# EAGLE design FeedbackShieldV4 (1) (EAGLE 9.7.0)
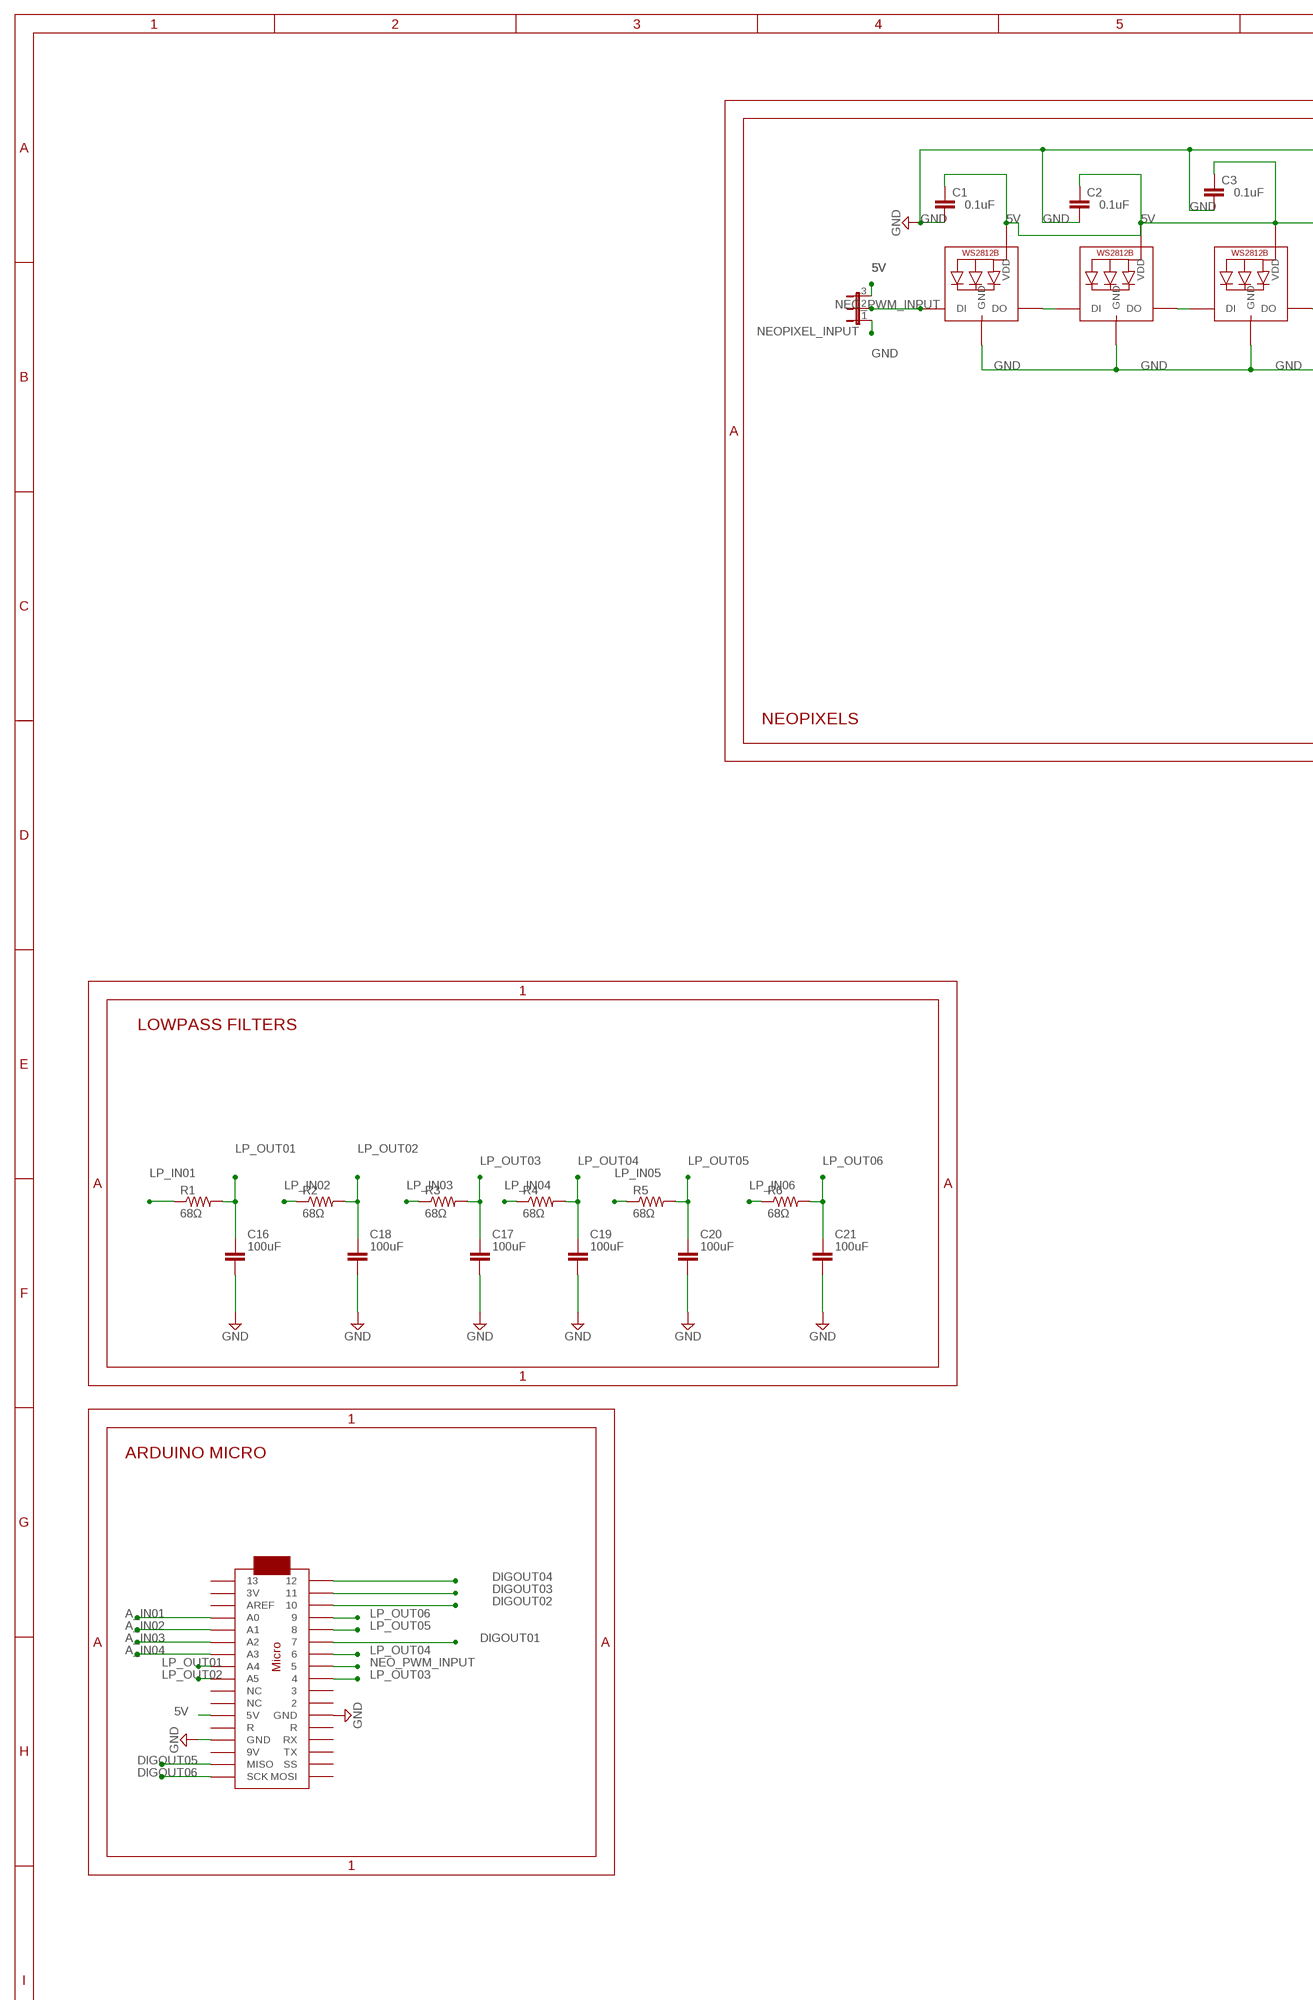
[diagram p0: schematic, sheet 1, part 1 of 2]
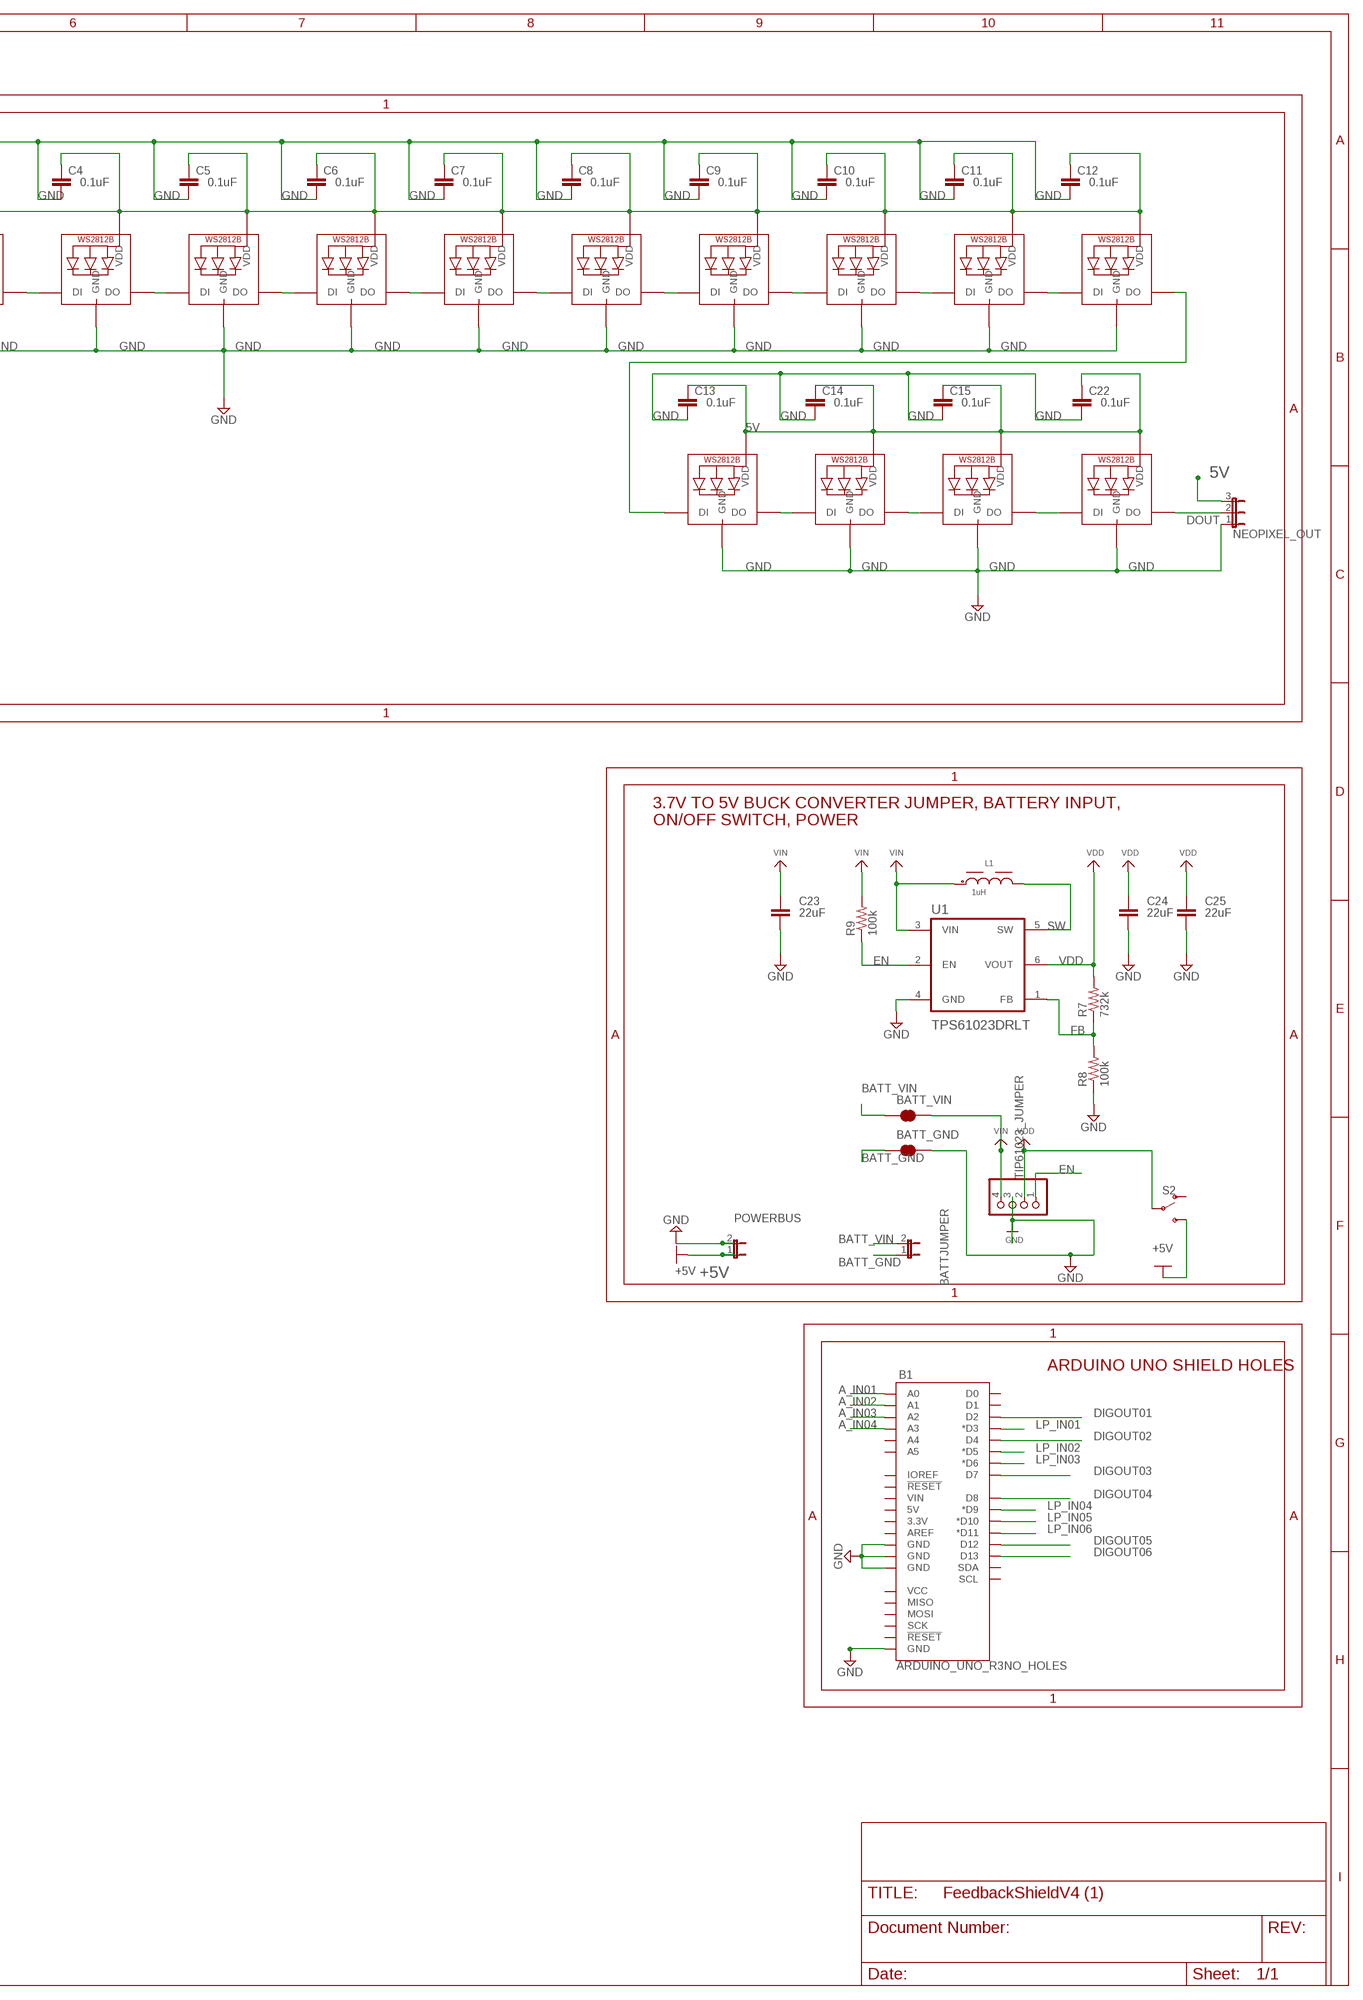
[diagram p1: schematic, sheet 1, part 2 of 2]

## Parts
B1  ARDUINO_UNO_R3NO_HOLES  [ARDUINO_R3_NO_HOLES]
BATT_GND  JUMPER-SMT_2_NC_TRACE_SILK  [SMT-JUMPER_2_NC_TRACE_SILK]
BATT_VIN  JUMPER-SMT_2_NC_TRACE_SILK  [SMT-JUMPER_2_NC_TRACE_SILK]
BATTJUMPER  JP1E  [JP1]
C1  0.1uF  C_CHIP-0603(1608-METRIC)  [CAPC1608X85]
C2  0.1uF  C_CHIP-0603(1608-METRIC)  [CAPC1608X85]
C3  0.1uF  C_CHIP-0603(1608-METRIC)  [CAPC1608X85]
C4  0.1uF  C_CHIP-0603(1608-METRIC)  [CAPC1608X85]
C5  0.1uF  C_CHIP-0603(1608-METRIC)  [CAPC1608X85]
C6  0.1uF  C_CHIP-0603(1608-METRIC)  [CAPC1608X85]
C7  0.1uF  C_CHIP-0603(1608-METRIC)  [CAPC1608X85]
C8  0.1uF  C_CHIP-0603(1608-METRIC)  [CAPC1608X85]
C9  0.1uF  C_CHIP-0603(1608-METRIC)  [CAPC1608X85]
C10  0.1uF  C_CHIP-0603(1608-METRIC)  [CAPC1608X85]
C11  0.1uF  C_CHIP-0603(1608-METRIC)  [CAPC1608X85]
C12  0.1uF  C_CHIP-0603(1608-METRIC)  [CAPC1608X85]
C13  0.1uF  C_CHIP-0603(1608-METRIC)  [CAPC1608X85]
C14  0.1uF  C_CHIP-0603(1608-METRIC)  [CAPC1608X85]
C15  0.1uF  C_CHIP-0603(1608-METRIC)  [CAPC1608X85]
C16  100uF  C_CHIP-1206(3216-METRIC)  [CAPC3216X135]
C17  100uF  C_CHIP-1206(3216-METRIC)  [CAPC3216X135]
C18  100uF  C_CHIP-1206(3216-METRIC)  [CAPC3216X135]
C19  100uF  C_CHIP-1206(3216-METRIC)  [CAPC3216X135]
C20  100uF  C_CHIP-1206(3216-METRIC)  [CAPC3216X135]
C21  100uF  C_CHIP-1206(3216-METRIC)  [CAPC3216X135]
C22  0.1uF  C_CHIP-0603(1608-METRIC)  [CAPC1608X85]
C23  22uF  C_CHIP-0805(2012-METRIC)  [CAPC2012X110]
C24  22uF  C_CHIP-0805(2012-METRIC)  [CAPC2012X110]
C25  22uF  C_CHIP-0805(2012-METRIC)  [CAPC2012X110]
L1  1uH  WE-MAPI_4020_744383560033  [WE-MAPI_4020]
MICRO  ARDUINOMICRO  [ARDUINOMICRO]
NEOPIXEL_INPUT  JP2E  [JP2]
NEOPIXEL_OUT  JP2E  [JP2]
PIN2  WS2812B3535  [LED3535]
PIN3  WS2812B3535  [LED3535]
PIN4  WS2812B3535  [LED3535]
PIN5  WS2812B3535  [LED3535]
PIN6  WS2812B3535  [LED3535]
PIN7  WS2812B3535  [LED3535]
PIN8  WS2812B3535  [LED3535]
PIN9  WS2812B3535  [LED3535]
PIN10  WS2812B3535  [LED3535]
PIN11  WS2812B3535  [LED3535]
PIN12  WS2812B3535  [LED3535]
PIN13  WS2812B3535  [LED3535]
PINA0  WS2812B3535  [LED3535]
PINA1  WS2812B3535  [LED3535]
PINA2  WS2812B3535  [LED3535]
PINA3  WS2812B3535  [LED3535]
POWERBUS  JP1E  [JP1]
R1  68Ω  R-US_CHIP-0805(2012-METRIC)  [RESC2012X65]
R2  68Ω  R-US_CHIP-0805(2012-METRIC)  [RESC2012X65]
R3  68Ω  R-US_CHIP-0805(2012-METRIC)  [RESC2012X65]
R4  68Ω  R-US_CHIP-0805(2012-METRIC)  [RESC2012X65]
R5  68Ω  R-US_CHIP-0805(2012-METRIC)  [RESC2012X65]
R6  68Ω  R-US_CHIP-0805(2012-METRIC)  [RESC2012X65]
R7  732k  R-US_CHIP-0805(2012-METRIC)  [RESC2012X65]
R8  100k  R-US_CHIP-0805(2012-METRIC)  [RESC2012X65]
R9  100k  R-US_CHIP-0805(2012-METRIC)  [RESC2012X65]
S2  SWITCH-SPDT-SMD-RIGHT-ANGLE  [SWITCH_SPST_SMD_A]
TIP61023_JUMPER  HEADER-1X4ROUND  [1X04_ROUND]
U1  TPS61023DRLT  [SOT50P160X60-6N]

## Nets
5V: C1.1 C2.1 C3.1 C4.1 C5.1 C6.1 C7.1 C8.1 C9.1 C10.1 C11.1 C12.1 C13.1 C14.1 C15.1 C22.1 MICRO.P$23(5V) NEOPIXEL_INPUT.3 NEOPIXEL_OUT.3 PIN2.2(VDD) PIN3.2(VDD) PIN4.2(VDD) PIN5.2(VDD) PIN6.2(VDD) PIN7.2(VDD) PIN8.2(VDD) PIN9.2(VDD) PIN10.2(VDD) PIN11.2(VDD) PIN12.2(VDD) PIN13.2(VDD) PINA0.2(VDD) PINA1.2(VDD) PINA2.2(VDD) PINA3.2(VDD)
+5V: POWERBUS.1 S2.3(S)
A_IN01: B1.A0 MICRO.P$31(A0)
A_IN02: B1.A1 MICRO.P$30(A1)
A_IN03: B1.A2 MICRO.P$29(A2)
A_IN04: B1.A3 MICRO.P$28(A3)
BATT_GND: BATT_GND.1 BATTJUMPER.1
BATT_VIN: BATT_VIN.1 BATTJUMPER.2
DIGOUT01: B1.D2 MICRO.P$6
DIGOUT02: B1.D4 MICRO.P$3
DIGOUT03: B1.D7 MICRO.P$2
DIGOUT04: B1.D8 MICRO.P$1
DIGOUT05: B1.D12 MICRO.P$19(MISO)
DIGOUT06: B1.D13 MICRO.P$18(SCK)
DOUT: NEOPIXEL_OUT.2 PINA3.3(DO)
EN: R9.1 TIP61023_JUMPER.1 U1.2(EN)
FB: R7.1 R8.2 U1.1(FB)
GND: B1.GND@1(GND) B1.GND@2(GND) B1.GND@3(GND) B1.GND@4(GND) BATT_GND.2 C1.2 C2.2 C3.2 C4.2 C5.2 C6.2 C7.2 C8.2 C9.2 C10.2 C11.2 C12.2 C13.2 C14.2 C15.2 C16.2 C17.2 C18.2 C19.2 C20.2 C21.2 C22.2 C23.2 C24.2 C25.2 MICRO.P$12(GND) MICRO.P$21(GND) NEOPIXEL_INPUT.1 NEOPIXEL_OUT.1 PIN2.4(GND) PIN3.4(GND) PIN4.4(GND) PIN5.4(GND) PIN6.4(GND) PIN7.4(GND) PIN8.4(GND) PIN9.4(GND) PIN10.4(GND) PIN11.4(GND) PIN12.4(GND) PIN13.4(GND) PINA0.4(GND) PINA1.4(GND) PINA2.4(GND) PINA3.4(GND) POWERBUS.2 R8.1 TIP61023_JUMPER.3 U1.4(GND)
LP_IN01: B1.D3(*D3) R1.1
LP_IN02: B1.D5(*D5) R2.1
LP_IN03: B1.D6(*D6) R3.1
LP_IN04: B1.D9(*D9) R4.1
LP_IN05: B1.D10(*D10) R5.1
LP_IN06: B1.D11(*D11) R6.1
LP_OUT01: C16.1 MICRO.P$27(A4) R1.2
LP_OUT02: C18.1 MICRO.P$26(A5) R2.2
LP_OUT03: C17.1 MICRO.P$9 R3.2
LP_OUT04: C19.1 MICRO.P$7 R4.2
LP_OUT05: C20.1 MICRO.P$5 R5.2
LP_OUT06: C21.1 MICRO.P$4 R6.2
N$1: PINA2.3(DO) PINA3.1(DI)
N$5: PIN12.3(DO) PIN13.1(DI)
N$21: PIN2.3(DO) PIN3.1(DI)
N$22: PIN3.3(DO) PIN4.1(DI)
N$23: PIN4.3(DO) PIN5.1(DI)
N$24: PIN5.3(DO) PIN6.1(DI)
N$25: PIN6.3(DO) PIN7.1(DI)
N$26: PIN7.3(DO) PIN8.1(DI)
N$27: PIN8.3(DO) PIN9.1(DI)
N$28: PIN9.3(DO) PIN10.1(DI)
N$29: PIN10.3(DO) PIN11.1(DI)
N$30: PIN11.3(DO) PIN12.1(DI)
N$31: PIN13.3(DO) PINA0.1(DI)
N$33: PINA0.3(DO) PINA1.1(DI)
N$34: PINA1.3(DO) PINA2.1(DI)
NEO_PWM_INPUT: MICRO.P$8 NEOPIXEL_INPUT.2 PIN2.1(DI)
SW: L1.2 U1.5(SW)
VDD: C24.1 C25.1 R7.2 S2.2(P) TIP61023_JUMPER.2 U1.6(VOUT)
VIN: BATT_VIN.2 C23.1 L1.1 R9.2 TIP61023_JUMPER.4 U1.3(VIN)
Unconnected: B1.3.3V B1.5V B1.A4 B1.A5 B1.AREF B1.D0 B1.D1 B1.IOREF B1.MISO B1.MOSI B1.RESET@1(!RESET!) B1.RESET@2(!RESET!) B1.SCK B1.SCL B1.SDA B1.VCC B1.VIN MICRO.P$10 MICRO.P$11 MICRO.P$13(R) MICRO.P$14(RX) MICRO.P$15(TX) MICRO.P$16(SS) MICRO.P$17(MOSI) MICRO.P$20(9V) MICRO.P$22(R) MICRO.P$24(NC) MICRO.P$25(NC) MICRO.P$32(AREF) MICRO.P$33(3V) MICRO.P$34 S2.1(O)

## Notes on the sheet
- NEOPIXELS
- 3.7V TO 5V BUCK CONVERTER JUMPER, BATTERY INPUT,
  ON/OFF SWITCH, POWER
- LOWPASS FILTERS
- ARDUINO UNO SHIELD HOLES
- ARDUINO MICRO

## Library data of the parts
B1 = SparkFun-Boards:ARDUINO_UNO_R3: Arduino R3 Footprint with SPI header Arduino Uno R3 Compatible Footprint. Matches PCB size of the original board. SparkFun Products: SAMD21 Dev Breakout <https://www.sparkfun.com/products/13672> RedBoard <https://www.sparkfun.com/products/12757> R3 Stackable Headers <https://www.sparkfun.com/products/11417>
BATT_GND BATT_VIN = SparkFun-Jumpers:JUMPER-SMT_2_NC_TRACE: Normally closed trace jumper This jumper has a trace between two pads so it's normally closed (NC). Use a razor knife to open the connection. For best results follow the IPC guidelines for cutting traces: Cutout at least 0.063 mm (0.005 in). Remove all loose material to clean up the cut area. Seal the cut with an approved epoxy. Reapply solder to reclose the connection.
BATTJUMPER POWERBUS = jumper:JP1E: JUMPER
C1-C15 C22-C25 = Tutorial - Fusion 360:C: Capacitor - Generic; CATEGORY: Capacitor
C16-C21 = Capacitor:C: Capacitor - Generic; CATEGORY: Capacitor
L1 = Eagle_WE-MAPI (rev20a):WE-MAPI_4020: WE-MAPI SMD Power Inductor Characteristics Magnetic iron alloy allows high rated currents Compact design Magnetically shielded High current capability and handles high transient current spikes Low acoustic noise and low leakage flux noise Operating temperature: –40 °C to 125 °C Product and Application Spotlight: Stay cool, be MAPI Applications DC/DC-converter for high current power supplies DC/DC-converter for Field Programmable Gate Array (FPGA) POL-converters Portable power like PDA, digital camera Mainboards/graphic cards Battery powered devices Wireless communication devices Power supplies for smart- phones, tablet PCs and other mobile devices <https://www.we-online.com/katalog/media/o14811v209%20Family_WE-MAPI.jpg> Details see: https://www.we-online.com/katalog/en/WE-MAPI Updated by Ella Wu, 2020-12-01 2020(C) Wurth Elektronik; DATASHEET-URL: https://www.we-online.com/catalog/datasheet/744383560033.pdf; FRES: 115MHz; IR: 9.6A; ISAT: 12.4A; MOUNT: SMT; PART-NUMBER: 744383560033; RDC-MAX: 7.2mOhm; RDC-TYP: 6mOhm; VALUE: 0.33uH
MICRO = adafruit:ARDUINOMICRO
NEOPIXEL_INPUT NEOPIXEL_OUT = jumper:JP2E: JUMPER
PIN2-PIN13 PINA0 PINA1-PINA3 = adafruit:WS2812B
R1-R9 = Tutorial - Fusion 360:R-US: Resistor Fixed - ANSI; CATEGORY: Resistor; SUB-CATEGORY: Fixed
S2 = SparkFun-Switches:SWITCH-SPDT: Single Pole, Double Throw (SPDT) Switch Single-pole, double-throw (SPDT) switch. Variant Overview SMD-AYZ0202 Surface Mount DPDT Switch <https://www.sparkfun.com/products/597> (COM-00597) Used on e.g. LilyPad Arduino USB - ATmega32U4 Board <https://www.sparkfun.com/products/12049> PTH-11.6X4.0MM SPDT Mini Power Switch <https://www.sparkfun.com/products/102> (COM-00102) Used on e.g. SparkFun Simon Says - Through-Hole Soldering Kit <https://www.sparkfun.com/products/10547> (KIT-10547) PTH-11.6X4.0MM-KIT KIT version of SPDT Mini Power Switch - Simplifies soldering by removing tStop of switch pins - only one side can be soldered. PTH-11.6X4.0MM-LOCK LOCK version of SPDT Mini Power Switch - Offset pins hold switch in place for easier soldering. SMD-RIGHT-ANGLE Surface Mount Right Angle Switch <https://www.sparkfun.com/products/10860> (COM-10860) Used on e.g. SparkFun ESP8266 Thing <https://www.sparkfun.com/products/13231>; PROD_ID: SWCH-10651; SF_SKU: COM-10860
TIP61023_JUMPER = microbuilder:HEADER-1X4: PIN HEADER
U1 = TPS61023DRLT:TPS61023DRLT

## Board
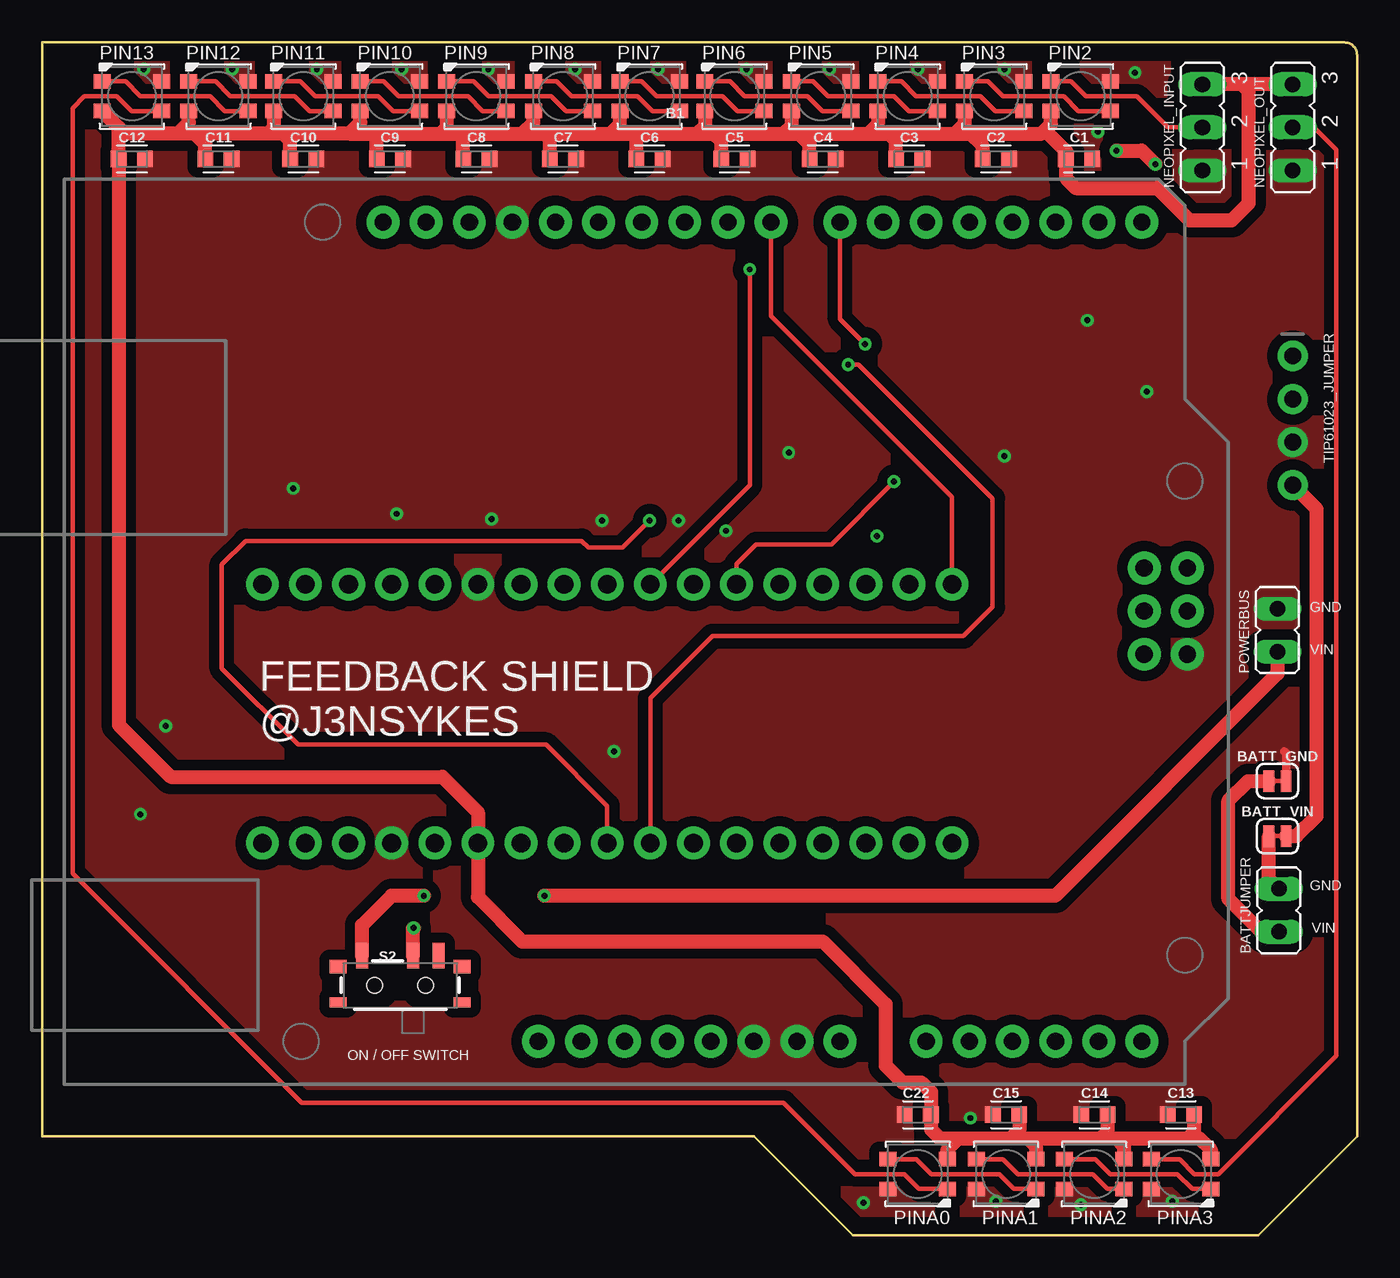
[diagram p2: board, top side]
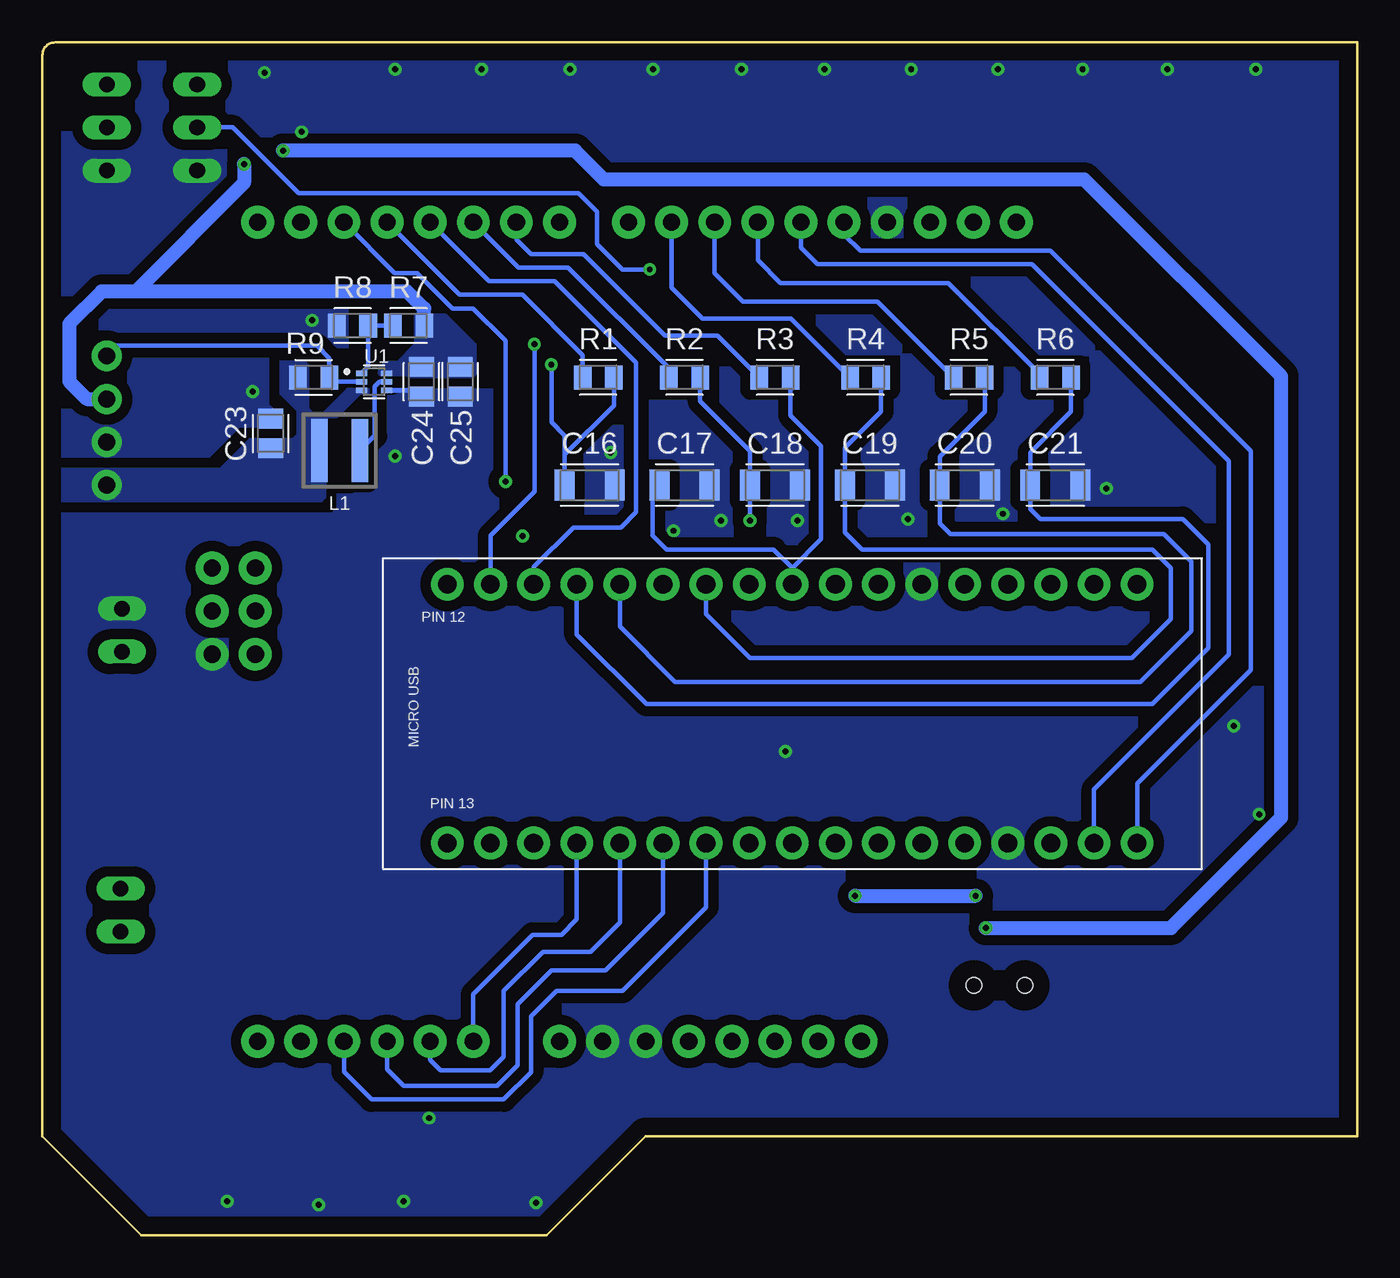
[diagram p3: board, bottom side, seen from below]

Size 77.45 x 70.28 mm. Coordinates in mm from the lower left corner, seen from the top.
Outline: 0,70.28 0,5.84 41.91,5.84 47.75,0 71.63,0 77.45,5.82 77.45,69.54 arc90 76.71,70.28 0,70.28
Copper layers (1*16): Top 0.035mm / dielectric 1.5mm / Bottom 0.035mm
Design rules "Fusion Electronics Design Rules": minimum track width 6mil, minimum drill 0.35mm, track to track 6mil, track to pad 6mil, pad to pad 6mil, via to via 6mil, smd to smd 6mil, copper to edge 40mil, drill to drill 6mil, minimum pad ring 10mil, minimum via ring 8mil, stop-mask expansion 4mil, vias tented up to drill 0mil, thermal gap 10mil

### Footprints (pad centres in the part's own frame; a part is rotated, then mirrored left to right if it is on the bottom)
ARDUINO_R3_NO_HOLES = drill 1.016 pad 1.93: 3.3V 1.27,-24.13; 5V 3.81,-24.13; A0 16.51,-24.13; A1 19.05,-24.13; A2 21.59,-24.13; A3 24.13,-24.13; A4 26.67,-24.13; A5 29.21,-24.13; AREF -10.414,24.13; D0 29.21,24.13; D1 26.67,24.13; D2 24.13,24.13; D3 21.59,24.13; D4 19.05,24.13; D5 16.51,24.13; D6 13.97,24.13; D7 11.43,24.13; D8 7.366,24.13; D9 4.826,24.13; D10 2.286,24.13; D11 -0.254,24.13; D12 -2.794,24.13; D13 -5.334,24.13; GND@1 6.35,-24.13; GND@2 8.89,-24.13; GND@3 -7.874,24.13; GND@4 31.89,-1.32; IOREF -3.81,-24.13; MISO 29.35,3.76; MOSI 31.89,1.22; NC -6.35,-24.13; RESET@1 -1.27,-24.13; RESET@2 29.35,-1.32; SCK 29.35,1.22; SCL -15.494,24.13; SDA -12.954,24.13; VCC 31.89,3.76; VIN 11.43,-24.13
SMT-JUMPER_2_NC_TRACE_SILK = smd 0.635 x 1.27: 1 -0.508,0; 2 0.508,0
JP1 = drill 0.914 long: 1 0,-1.27; 2 0,1.27
CAPC1608X85 = smd 0.921 x 0.97: 1 -0.775,0; 2 0.775,0
CAPC3216X135 = smd 1.165 x 1.815: 1 -1.475,0; 2 1.475,0
CAPC2012X110 = smd 1.165 x 1.465: 1 -0.875,0; 2 0.875,0
WE-MAPI_4020 = smd 0.98 x 3.7: 1 -1.185,0; 2 1.185,0
ARDUINOMICRO = drill 1.1 pad 1.93: P$1 -20.32,7.62; P$2 -17.78,7.62; P$3 -15.24,7.62; P$4 -12.7,7.62; P$5 -10.16,7.62; P$6 -7.62,7.62; P$7 -5.08,7.62; P$8 -2.54,7.62; P$9 0,7.62; P$10 2.54,7.62; P$11 5.08,7.62; P$12 12.7,-7.62; P$13 10.16,-7.62; P$14 12.7,7.62; P$15 15.24,7.62; P$16 17.78,7.62; P$17 20.32,7.62; P$18 20.32,-7.62; P$19 17.78,-7.62; P$20 15.24,-7.62; P$21 7.62,7.62; P$22 10.16,7.62; P$23 7.62,-7.62; P$24 5.08,-7.62; P$25 2.54,-7.62; P$26 0,-7.62; P$27 -2.54,-7.62; P$28 -5.08,-7.62; P$29 -7.62,-7.62; P$30 -10.16,-7.62; P$31 -12.7,-7.62; P$32 -15.24,-7.62; P$33 -17.78,-7.62; P$34 -20.32,-7.62
JP2 = drill 0.914 long: 1 -2.54,0; 2 0,0; 3 2.54,0
LED3535 = smd 1 x 0.85: 1 -1.75,0.875; 2 -1.75,-0.875; 3 1.75,-0.875; 4 1.75,0.875
RESC2012X65 = smd 1.031 x 1.42: 1 -0.919,0; 2 0.919,0
SWITCH_SPST_SMD_A = smd 0.7 x 1.5: 1 -2.25,-1.75; 2 -0.75,-1.75; 3 2.25,-1.75 | smd 1 x 0.6: GND1 -3.65,1; GND3 3.65,1 | smd 1 x 0.8: GND2 -3.65,-1.1; GND4 3.65,-1.1 | hole 0.9: -1.5,0; 1.5,0
1X04_ROUND = drill 1 pad 1.778: 1 -3.81,0; 2 -1.27,0; 3 1.27,0; 4 3.81,0
SOT50P160X60-6N = smd 0.66 x 0.31: 1 -0.735,0.5; 2 -0.735,0; 3 -0.735,-0.5; 4 0.735,-0.5; 5 0.735,0; 6 0.735,0.5

### Placement (x,y rotation side)
B1  35.56,35.56 0 top
BATT_GND  72.76,26.77 0 top
BATT_VIN  72.76,23.52 0 top
BATTJUMPER  72.84,19.15 0 top
C1  61.07,63.41 0 top
C2  56.17,63.41 0 top
C3  51.07,63.41 0 top
C4  45.97,63.41 0 top
C5  40.77,63.41 0 top
C6  35.77,63.41 0 top
C7  30.67,63.41 0 top
C8  25.57,63.41 0 top
C9  20.47,63.41 0 top
C10  15.37,63.41 0 top
C11  10.37,63.41 0 top
C12  5.27,63.41 0 top
C13  67.07,7.11 180 top
C14  61.97,7.11 180 top
C15  56.77,7.11 180 top
C16  45.21,44.2 0 bottom
C17  39.62,44.2 0 bottom
C18  34.29,44.2 0 bottom
C19  28.7,44.2 0 bottom
C20  23.11,44.2 0 bottom
C21  17.78,44.2 0 bottom
C22  51.57,7.11 180 top
C23  64.01,47.24 90 bottom
C24  55.12,50.29 270 bottom
C25  52.83,50.29 270 bottom
L1  59.94,46.23 0 bottom
MICRO  33.27,30.73 0 bottom
NEOPIXEL_INPUT  68.33,65.28 90 top
NEOPIXEL_OUT  73.66,65.28 90 top
PIN2  61.17,67.11 0 top
PIN3  56.07,67.11 0 top
PIN4  50.97,67.11 0 top
PIN5  45.87,67.11 0 top
PIN6  40.77,67.11 0 top
PIN7  35.77,67.11 0 top
PIN8  30.67,67.11 0 top
PIN9  25.57,67.11 0 top
PIN10  20.47,67.11 0 top
PIN11  15.37,67.11 0 top
PIN12  10.37,67.11 0 top
PIN13  5.27,67.11 0 top
PINA0  51.57,3.61 180 top
PINA1  56.77,3.61 180 top
PINA2  61.97,3.61 180 top
PINA3  67.07,3.61 180 top
POWERBUS  72.76,35.66 0 top
R1  44.7,50.55 0 bottom
R2  39.62,50.55 0 bottom
R3  34.29,50.55 0 bottom
R4  28.96,50.55 0 bottom
R5  22.86,50.55 0 bottom
R6  17.78,50.55 0 bottom
R7  55.88,53.59 0 bottom
R8  59.18,53.59 0 bottom
R9  61.47,50.55 180 bottom
S2  21.08,14.73 180 top
TIP61023_JUMPER  73.66,48.01 270 top
U1  57.91,50.29 0 bottom

### Tracks (layer width: path | path; a pad name or v marks a point on that pad's centre or on a via)
5V
  Top 0.813: PIN11.2 13.62,65.26 13.27,64.91 | 18.07,64.91 14.17,64.91 | 14.17,64.91 13.27,64.91 | 13.27,64.91 8.97,64.91 | 8.97,64.91 7.97,64.91 | 7.97,64.91 4.75,64.91 4.5,65.17 | 18.07,64.91 18.72,65.56 PIN10.2 | 18.07,64.91 19.57,64.91 | 19.57,64.91 23.47,64.91 | 23.47,64.91 24.57,64.91 | 24.57,64.91 28.27,64.91 | 28.27,64.91 29.57,64.91 | 29.57,64.91 33.47,64.91 | 33.47,64.91 34.77,64.91 | 34.77,64.91 38.57,64.91 | 38.57,64.91 39.57,64.91 | 39.57,64.91 43.67,64.91 | 43.67,64.91 44.57,64.91 | 44.57,64.91 48.67,64.91 | 48.67,64.91 49.87,64.91 | 49.87,64.91 53.77,64.91 | 53.77,64.91 54.67,64.91 | 54.67,64.91 58.87,64.91 59.07,65.11 | 59.07,65.11 59.42,65.46 PIN2.2 | PIN3.2 54.32,65.46 53.77,64.91 | PIN4.2 49.22,65.46 48.67,64.91 | PIN5.2 44.12,65.36 43.67,64.91 | PIN6.2 39.02,65.36 38.57,64.91 | PIN7.2 34.02,65.46 33.47,64.91 | PIN8.2 28.92,65.56 28.27,64.91 | PIN9.2 23.82,65.26 23.47,64.91 | PIN13.2 4.5,65.26 4.5,65.17 | PIN12.2 8.62,65.56 7.97,64.91 | 4.5,65.17 C12.1 4.5,30.08 7.57,27.01 23.57,27.01 25.65,24.93 MICRO.P$23 25.65,19.93 28.27,17.31 45.97,17.31 49.67,13.61 49.67,10.01 50.67,9.01 51.77,9.01 52.35,8.44 C22.1 52.35,6.23 52.87,5.71 53.97,5.71 | C11.1 9.59,64.28 8.97,64.91 | C10.1 14.59,64.48 14.17,64.91 | C9.1 19.7,64.78 19.57,64.91 | C8.1 24.79,64.69 24.57,64.91 | C7.1 29.89,64.58 29.57,64.91 | C6.1 35,64.69 34.77,64.91 | C5.1 40,64.48 39.57,64.91 | C2.1 55.4,64.19 54.67,64.91 | 59.07,65.11 60.3,63.89 C1.1 60.3,62.29 60.87,61.71 65.67,61.71 67.57,59.81 70.07,59.81 71.07,60.81 71.07,67.42 70.67,67.82 | C3.1 50.3,64.48 49.87,64.91 | C4.1 45.2,64.28 44.57,64.91 | NEOPIXEL_OUT.3 70.67,67.82 | 70.67,67.82 NEOPIXEL_INPUT.3
  Top 0.813: 53.97,5.71 57.07,5.71 | 57.07,5.71 58.07,5.71 | 58.07,5.71 62.37,5.71 | 62.37,5.71 63.27,5.71 | 63.27,5.71 67.47,5.71 | 67.47,5.71 68.17,5.71 68.82,5.06 PINA3.2 | C13.1 67.84,6.08 67.47,5.71 | PINA2.2 63.72,5.26 63.27,5.71 | C14.1 62.75,6.08 62.37,5.71 | C15.1 57.55,6.19 57.07,5.71 | PINA0.2 53.32,5.06 53.97,5.71 | PINA1.2 58.52,5.26 58.07,5.71
+5V  (via drill 0.35)
  Top 0.813: POWERBUS.1 72.76,33.1 59.67,20.01 v29.57,20.01 | v22.47,20.01 20.57,20.01 18.83,18.27 S2.3
  Bottom 0.813: v29.57,20.01 v22.47,20.01
A_IN01
  Bottom 0.254: MICRO.P$31 45.97,18.61 46.87,17.71 48.57,17.71 52.07,14.21 B1.A0
A_IN02
  Bottom 0.254: MICRO.P$30 43.43,18.45 45.17,16.71 47.97,16.71 50.27,14.41 50.27,10.51 51.07,9.71 53.99,9.71 54.61,10.33 B1.A1
A_IN03
  Bottom 0.254: MICRO.P$29 40.89,18.99 44.27,15.61 47.47,15.61 49.47,13.61 49.47,10.01 50.67,8.81 56.17,8.81 57.15,9.79 B1.A2
A_IN04
  Bottom 0.254: MICRO.P$28 38.35,19.33 43.27,14.41 47.17,14.41 48.67,12.91 48.67,9.61 50.27,8.01 58.07,8.01 59.69,9.63 B1.A3
BATT_GND
  Top 0.813: BATTJUMPER.1 71.8,17.88 69.87,19.81 69.87,25.61 71.03,26.77 BATT_GND.1
BATT_VIN
  Top 0.813: BATTJUMPER.2 72.25,21.01 BATT_VIN.1
DIGOUT01  (via drill 0.35)
  Top 0.254: v50.17,44.41 46.47,40.71 42.05,40.71 40.89,39.55 MICRO.P$6
  Bottom 0.254: v50.17,44.41 50.17,52.71 52.07,54.61 53.3,54.61 55.39,56.7 56.7,56.7 B1.D2
DIGOUT02
  Bottom 0.254: B1.D4 51.13,56.21 47.27,56.21 42.47,51.41 42.47,42.61 43.37,41.71 46.17,41.71 48.51,39.37 MICRO.P$3
DIGOUT03  (via drill 0.35)
  Top 0.254: v48.47,52.51 46.99,53.99 B1.D7
  Bottom 0.254: MICRO.P$2 51.05,41.23 48.47,43.81 v48.47,52.51
DIGOUT04
  Top 0.254: B1.D8 42.93,54.15 53.59,43.49 MICRO.P$1
DIGOUT05
  Bottom 0.254: MICRO.P$19 15.49,26.29 7.57,34.21 7.57,45.61 19.17,57.21 31.79,57.21 32.77,58.19 B1.D12
DIGOUT06
  Bottom 0.254: B1.D13 30.23,58.97 29.27,58.01 18.07,58.01 6.27,46.21 6.27,33.31 12.95,26.63 MICRO.P$18
DOUT
  Top 0.254: PINA3.3 66.99,4.49 67.87,3.61 69.27,3.61 76.23,10.58 76.23,63.95 74.9,65.28 NEOPIXEL_OUT.2
EN
  Bottom 0.254: U1.2 60.3,50.29 R9.1 60.55,51.69 61.27,52.41 73.07,52.41 TIP61023_JUMPER.1
FB
  Bottom 0.254: R7.1 R8.2 58.26,51.18 U1.1
GND  (via drill 0.35)
  Top 0.508: BATT_GND.2 73.27,28.41 73.17,28.51
  Bottom 0.305: U1.4 55.49,49.79 C24.2
  other vias: 5.97,68.71 11.17,68.71 16.17,68.71 21.17,68.71 26.27,68.71 31.37,68.71 36.27,68.71 41.47,68.71 46.37,68.71 51.57,68.71 56.67,68.71 64.37,68.51 61.57,53.91 65.07,49.71 56.67,45.91 61.17,1.81 66.57,2.01 56.17,2.01 48.37,1.91 43.97,46.11 37.47,42.11 32.97,42.11 26.47,42.21 20.87,42.51 14.77,44.01 33.67,28.51 5.77,24.81 54.67,6.91 40.27,41.51 62.17,65.01 7.27,30.01
  pour Top (isolate 0.61, rank 2, no thermals): 3.44,-4.78 77.1,-4.78 81.86,-0.02 81.86,68.64 77.1,73.4 -0.56,73.4 -3.32,70.64 -3.32,1.98
  pour Bottom (isolate 0.61, rank 2, no thermals): 3.44,-6.78 78.1,-6.78 82.86,-2.02 82.86,70.64 78.1,75.4 -1.56,75.4 -5.32,71.64 -5.32,1.98
LP_IN01
  Bottom 0.254: B1.D3 52.87,55.41 49.17,55.41 45.62,51.86 R1.1
LP_IN02
  Bottom 0.254: B1.D5 49.39,57.01 46.47,57.01 40.54,51.08 R2.1
LP_IN03
  Bottom 0.254: B1.D6 49.53,58.67 48.67,57.81 45.57,57.81 40.77,53.01 37.67,53.01 R3.1
LP_IN04
  Bottom 0.254: B1.D9 40.39,55.83 38.57,54.01 33.34,54.01 R4.1
LP_IN05
  Bottom 0.254: B1.D10 37.85,56.69 36.17,55.01 28.24,55.01 R5.1
LP_IN06
  Bottom 0.254: B1.D11 35.31,57.45 33.97,56.11 24.06,56.11 18.7,50.75 R6.1
LP_OUT01  (via drill 0.35)
  Top 0.254: MICRO.P$27 35.81,31.65 39.47,35.31 54.27,35.31 55.97,37.01 55.97,43.41 48.07,51.31 v47.47,51.31
  Bottom 0.254: 46.69,45.99 C16.1 | 46.69,45.99 43.78,48.9 R1.2 | v47.47,51.31 47.47,47.91 46.69,47.13 46.69,45.99
LP_OUT02  (via drill 0.35)
  Top 0.254: MICRO.P$26 33.27,25.31 29.67,28.91 15.07,28.91 10.57,33.41 10.57,39.51 11.97,40.91 31.77,40.91 32.17,40.51 34.17,40.51 v35.77,42.11
  Bottom 0.254: R2.2 38.7,49.14 35.77,46.21 C18.1 v35.77,42.11
LP_OUT03
  Bottom 0.254: R3.2 33.37,48.31 31.57,46.51 31.57,41.01 33.27,39.31 | 33.27,39.31 MICRO.P$9 | C17.1 41.5,43.8 41.5,41.24 40.67,40.41 34.38,40.41 33.27,39.31
LP_OUT04
  Bottom 0.254: R4.2 28.04,48.54 30.18,46.4 C19.1 30.18,41.42 29.17,40.41 12.07,40.41 10.97,39.31 10.97,36.31 13.27,34.01 35.77,34.01 38.35,36.59 MICRO.P$7
LP_OUT05
  Bottom 0.254: R5.2 21.94,48.54 24.59,45.89 C20.1 24.59,41.93 23.97,41.31 11.37,41.31 9.77,39.71 9.77,35.61 12.77,32.61 40.17,32.61 43.43,35.87 MICRO.P$5
LP_OUT06
  Bottom 0.254: R6.2 16.86,48.52 19.25,46.12 C21.1 19.25,42.8 18.67,42.21 10.27,42.21 8.77,40.71 8.77,34.61 12.07,31.31 41.87,31.31 45.97,35.41 MICRO.P$4
N$1
  Top 0.254: PINA3.1 67.74,2.74 66.87,3.61 62.91,3.61 62.03,4.49 PINA2.3
N$2  (via drill 0.35)
  other vias: 49.17,41.21
N$5
  Top 0.254: PIN13.1 4.89,67.98 5.77,67.11 9.87,67.11 10.74,66.23 PIN12.3
N$21
  Top 0.254: PIN3.1 55.7,67.98 56.57,67.11 60.17,67.11 61.05,66.23 PIN2.3
N$22
  Top 0.254: PIN4.1 50.6,67.98 51.47,67.11 55.27,67.11 56.15,66.23 PIN3.3
N$23
  Top 0.254: PIN5.1 45.4,67.98 46.27,67.11 50.17,67.11 51.05,66.23 PIN4.3
N$24
  Top 0.254: PIN6.1 40.5,67.98 41.37,67.11 45.07,67.11 45.95,66.23 PIN5.3
N$25
  Top 0.254: PIN7.1 35.3,67.98 36.17,67.11 40.07,67.11 40.95,66.23 PIN6.3
N$26
  Top 0.254: PIN8.1 30.29,67.98 31.17,67.11 35.07,67.11 35.95,66.23 PIN7.3
N$27
  Top 0.254: PIN9.1 25.39,67.98 26.27,67.11 29.97,67.11 30.84,66.23 PIN8.3
N$28
  Top 0.254: PIN10.1 20.09,67.98 20.97,67.11 25.07,67.11 25.95,66.23 PIN9.3
N$29
  Top 0.254: PIN11.1 15.2,67.98 16.07,67.11 19.77,67.11 20.64,66.23 PIN10.3
N$30
  Top 0.254: PIN12.1 10.2,67.98 11.07,67.11 14.87,67.11 15.74,66.23 PIN11.3
N$31
  Top 0.254: PINA0.1 51.65,2.74 50.77,3.61 47.87,3.61 43.67,7.81 15.27,7.81 1.77,21.31 1.77,66.41 2.47,67.11 4.37,67.11 5.25,66.23 PIN13.3
N$33
  Top 0.254: PINA0.3 51.49,4.49 52.36,3.61 56.37,3.61 57.25,2.74 PINA1.1
N$34
  Top 0.254: PINA1.3 56.6,4.49 57.47,3.61 61.87,3.61 62.75,2.74 PINA2.1
NEO_PWM_INPUT  (via drill 0.35)
  Top 0.254: PIN2.1 60.6,67.98 61.47,67.11 64.47,67.11 66.3,65.28 NEOPIXEL_INPUT.2 | MICRO.P$8 41.67,44.21 v41.67,56.91
  Bottom 0.254: v41.67,56.91 43.27,56.91 44.77,58.41 44.77,60.31 45.87,61.41 62.37,61.41 66.24,65.28 NEOPIXEL_INPUT.2
SW
  Bottom 0.254: L1.2 57.87,47.12 57.87,50.01 57.59,50.29 U1.5
VDD  (via drill 0.35)
  Top 0.813: S2.2 21.83,18.07 v21.87,18.11 | v63.27,63.91 64.77,63.91 v65.57,63.11
  Bottom 0.813: R7.2 54.96,54.6 55.97,55.61 71.97,55.61 | TIP61023_JUMPER.2 74.84,49.28 75.87,50.31 75.87,53.71 73.97,55.61 72.87,55.61 71.97,55.61 | v21.87,18.11 10.97,18.11 4.47,24.61 4.47,50.61 16.07,62.21 44.37,62.21 46.07,63.91 v63.27,63.91 | v65.57,63.11 65.57,62.01 71.97,55.61
  pour Bottom (no thermals): 56.54,51.38 56.5,51.4 55.46,52.44 55.44,52.48 55.44,54.18 53.72,54.18 52,52.46 52,50.76 52.12,50.64 55.82,50.64 55.9,50.72 55.94,50.74 57.52,50.74 57.54,50.76 57.54,51.06 57.22,51.38
VIN
  Top 0.813: BATT_VIN.2 73.88,23.52 75.07,24.71 75.07,42.79 TIP61023_JUMPER.4
  pour Bottom (no thermals): 60.77,47.54 60.78,47.51 60.78,43.47 60.99,43.26 77.18,43.26 77.39,43.47 77.39,44.67 76.93,45.14 67.04,45.14 67.01,45.15 65.25,46.91 62.72,46.91 62.69,46.93 62.42,47.2 62.41,47.23 62.41,48.53 62.42,48.56 63.42,49.56 63.42,51.49 62.01,51.49 61.8,51.28 61.8,48.75 61.79,48.72 61.51,48.45 61.48,48.44 60.94,48.44 60.92,48.45 59.5,49.86 58.24,49.86 58.24,49.61 58.69,49.61 58.72,49.59

### Text on the board
tPlace: GND | VIN | FEEDBACK SHIELD / @J3NSYKES | GND | VIN | ON / OFF SWITCH
bPlace: PIN 12 | MICRO USB | PIN 13